# EAGLE board tf328 (EAGLE 8.2.2), part 1 of 2
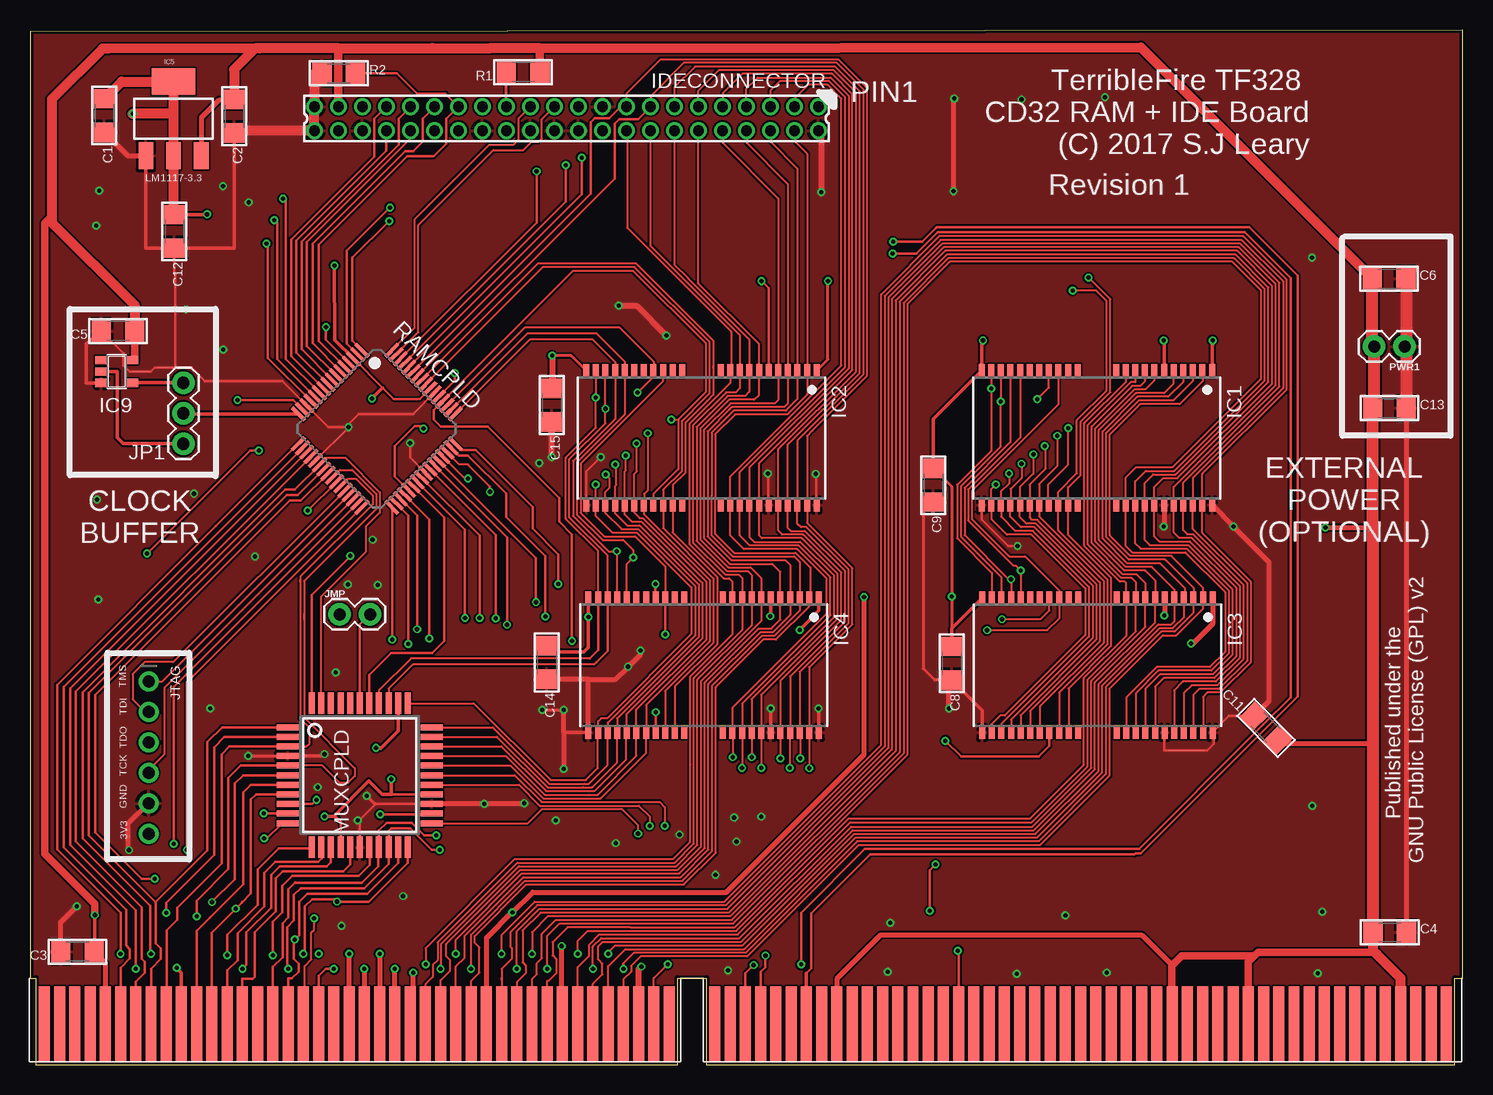
[diagram p4: board, top side]
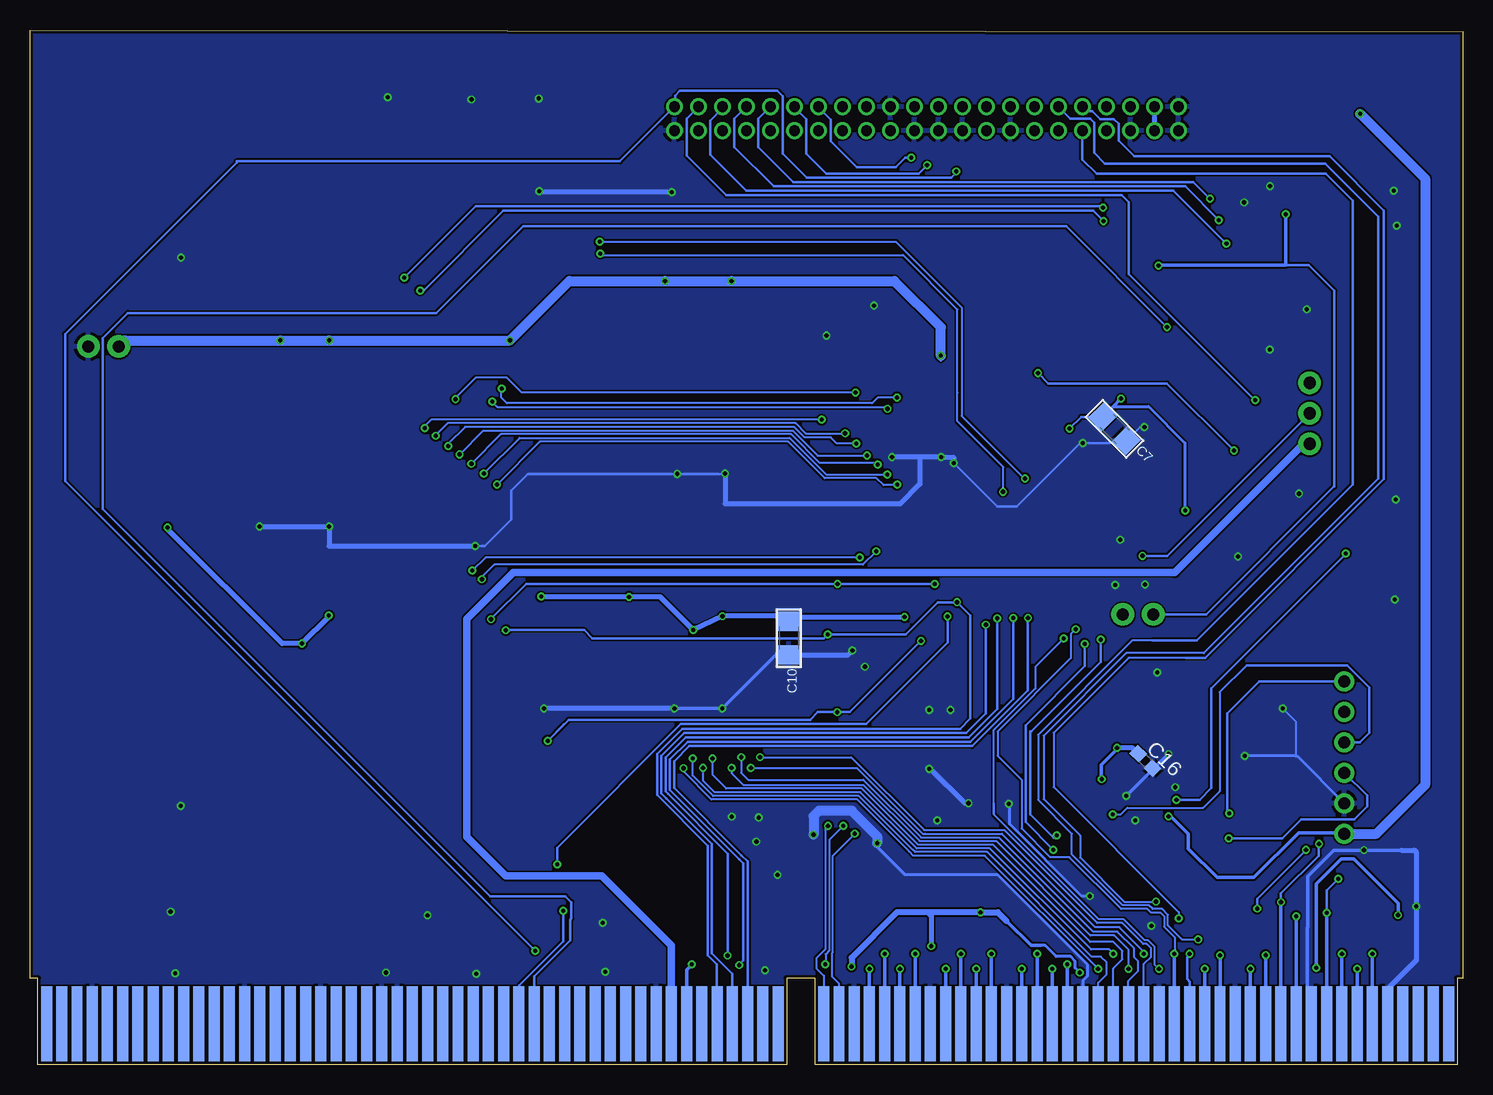
[diagram p5: board, bottom side, seen from below]

Size 119.41 x 86.26 mm. Coordinates in mm from the lower left corner, seen from the top.
Outline: 0.48,0 53.97,0 53.97,7.21 56.36,7.21 56.36,0 118.74,0 118.74,7.21 119.41,7.21 119.41,86.26 0,86.13 0,7.21 0.48,7.21 0.48,0
Copper layers (1*16): Top 0.035mm / dielectric 1.5mm / Bottom 0.035mm
Design rules "dirt_cheap_dirty_boards.v1 (1) *": minimum track width 6mil, minimum drill 12mil, track to track 6mil, track to pad 6mil, pad to pad 6mil, via to via 6mil, smd to smd 0mil, copper to edge 10mil, drill to drill 10mil, minimum pad ring 10mil, minimum via ring 6mil, stop-mask expansion 2mil, vias tented up to drill 25mil, thermal gap 10mil

## Footprints (pad centres in the part's own frame; a part is rotated, then mirrored left to right if it is on the bottom)
1206 = smd 1.6 x 1.8: 1 -1.4,0; 2 1.4,0
C0603 = smd 1.1 x 1: 1 -0.85,0; 2 0.85,0
MCA_CONN_182 = smd 0.914 x 6.223 bottom: PIN1 -5.08,3.81; PIN3 -3.81,3.81; PIN5 -2.54,3.81; PIN7 -1.27,3.81; PIN9 0,3.81; PIN11 1.27,3.81; PIN13 2.54,3.81; PIN15 3.81,3.81; PIN17 5.08,3.81; PIN19 6.35,3.81; PIN21 7.62,3.81; PIN23 8.89,3.81; PIN25 10.16,3.81; PIN27 11.43,3.81; PIN29 12.7,3.81; PIN31 13.97,3.81; PIN33 15.24,3.81; PIN35 16.51,3.81; PIN37 17.78,3.81; PIN39 19.05,3.81; PIN41 20.32,3.81; PIN43 21.59,3.81; PIN45 22.86,3.81; PIN47 24.13,3.81; PIN49 25.4,3.81; PIN51 26.67,3.81; PIN53 27.94,3.81; PIN55 29.21,3.81; PIN57 30.48,3.81; PIN59 31.75,3.81; PIN61 33.02,3.81; PIN63 34.29,3.81; PIN65 35.56,3.81; PIN67 36.83,3.81; PIN69 38.1,3.81; PIN71 39.37,3.81; PIN73 40.64,3.81; PIN75 41.91,3.81; PIN77 43.18,3.81; PIN79 44.45,3.81; PIN81 45.72,3.81; PIN83 46.99,3.81; PIN85 50.8,3.81; PIN87 52.07,3.81; PIN89 53.34,3.81; PIN91 54.61,3.81; PIN93 55.88,3.81; PIN95 57.15,3.81; PIN97 58.42,3.81; PIN99 59.69,3.81; PIN101 60.96,3.81; PIN103 62.23,3.81; PIN105 63.5,3.81; PIN107 64.77,3.81; PIN109 66.04,3.81; PIN111 67.31,3.81; PIN113 68.58,3.81; PIN115 69.85,3.81; PIN117 71.12,3.81; PIN119 72.39,3.81; PIN121 73.66,3.81; PIN123 74.93,3.81; PIN125 76.2,3.81; PIN127 77.47,3.81; PIN129 78.74,3.81; PIN131 80.01,3.81; PIN133 81.28,3.81; PIN135 82.55,3.81; PIN137 83.82,3.81; PIN139 85.09,3.81; PIN141 86.36,3.81; PIN143 87.63,3.81; PIN145 88.9,3.81; PIN147 90.17,3.81; PIN149 91.44,3.81; PIN151 92.71,3.81; PIN153 93.98,3.81; PIN155 95.25,3.81; PIN157 96.52,3.81; PIN159 97.79,3.81; PIN161 99.06,3.81; PIN163 100.33,3.81; PIN165 101.6,3.81; PIN167 102.87,3.81; PIN169 104.14,3.81; PIN171 105.41,3.81; PIN173 106.68,3.81; PIN175 107.95,3.81; PIN177 109.22,3.81; PIN179 110.49,3.81; PIN181 111.76,3.81 | smd 0.914 x 6.223: PIN2 -5.08,3.81; PIN4 -3.81,3.81; PIN6 -2.54,3.81; PIN8 -1.27,3.81; PIN10 0,3.81; PIN12 1.27,3.81; PIN14 2.54,3.81; PIN16 3.81,3.81; PIN18 5.08,3.81; PIN20 6.35,3.81; PIN22 7.62,3.81; PIN24 8.89,3.81; PIN26 10.16,3.81; PIN28 11.43,3.81; PIN30 12.7,3.81; PIN32 13.97,3.81; PIN34 15.24,3.81; PIN36 16.51,3.81; PIN38 17.78,3.81; PIN40 19.05,3.81; PIN42 20.32,3.81; PIN44 21.59,3.81; PIN46 22.86,3.81; PIN48 24.13,3.81; PIN50 25.4,3.81; PIN52 26.67,3.81; PIN54 27.94,3.81; PIN56 29.21,3.81; PIN58 30.48,3.81; PIN60 31.75,3.81; PIN62 33.02,3.81; PIN64 34.29,3.81; PIN66 35.56,3.81; PIN68 36.83,3.81; PIN70 38.1,3.81; PIN72 39.37,3.81; PIN74 40.64,3.81; PIN76 41.91,3.81; PIN78 43.18,3.81; PIN80 44.45,3.81; PIN82 45.72,3.81; PIN84 46.99,3.81; PIN86 50.8,3.81; PIN88 52.07,3.81; PIN90 53.34,3.81; PIN92 54.61,3.81; PIN94 55.88,3.81; PIN96 57.15,3.81; PIN98 58.42,3.81; PIN100 59.69,3.81; PIN102 60.96,3.81; PIN104 62.23,3.81; PIN106 63.5,3.81; PIN108 64.77,3.81; PIN110 66.04,3.81; PIN112 67.31,3.81; PIN114 68.58,3.81; PIN116 69.85,3.81; PIN118 71.12,3.81; PIN120 72.39,3.81; PIN122 73.66,3.81; PIN124 74.93,3.81; PIN126 76.2,3.81; PIN128 77.47,3.81; PIN130 78.74,3.81; PIN132 80.01,3.81; PIN134 81.28,3.81; PIN136 82.55,3.81; PIN138 83.82,3.81; PIN140 85.09,3.81; PIN142 86.36,3.81; PIN144 87.63,3.81; PIN146 88.9,3.81; PIN148 90.17,3.81; PIN150 91.44,3.81; PIN152 92.71,3.81; PIN154 93.98,3.81; PIN156 95.25,3.81; PIN158 96.52,3.81; PIN160 97.79,3.81; PIN162 99.06,3.81; PIN164 100.33,3.81; PIN166 101.6,3.81; PIN168 102.87,3.81; PIN170 104.14,3.81; PIN172 105.41,3.81; PIN174 106.68,3.81; PIN176 107.95,3.81; PIN178 109.22,3.81; PIN180 110.49,3.81; PIN182 111.76,3.81
TSOP44(50)-II = smd 0.5 x 1.1: 1 -9.6,-5.6; 2 -8.8,-5.6; 3 -8,-5.6; 4 -7.2,-5.6; 5 -6.4,-5.6; 6 -5.6,-5.6; 7 -4.8,-5.6; 8 -4,-5.6; 9 -3.2,-5.6; 10 -2.4,-5.6; 11 -1.6,-5.6; 12 1.6,-5.6; 13 2.4,-5.6; 14 3.2,-5.6; 15 4,-5.6; 16 4.8,-5.6; 17 5.6,-5.6; 18 6.4,-5.6; 19 7.2,-5.6; 20 8,-5.6; 21 8.8,-5.6; 22 9.6,-5.6; 23 9.6,5.6; 24 8.8,5.6; 25 8,5.6; 26 7.2,5.6; 27 6.4,5.6; 28 5.6,5.6; 29 4.8,5.6; 30 4,5.6; 31 3.2,5.6; 32 2.4,5.6; 33 1.6,5.6; 34 -1.6,5.6; 35 -2.4,5.6; 36 -3.2,5.6; 37 -4,5.6; 38 -4.8,5.6; 39 -5.6,5.6; 40 -6.4,5.6; 41 -7.2,5.6; 42 -8,5.6; 43 -8.8,5.6; 44 -9.6,5.6
SOT223 = smd 1.219 x 2.235: 1 -2.311,-3.099; 2 0,-3.099; 3 2.311,-3.099 | smd 3.6 x 2.2: 4 0,3.099
SOT23-5 = smd 0.69 x 0.99: 1 -0.95,-1.29; 2 0,-1.29; 3 0.95,-1.29; 4 0.95,1.3; 5 -0.95,1.3
87758-4416 = drill 0.9 pad 1.27: 1 -21,-1; 2 -21,1; 3 -19,-1; 4 -19,1; 5 -17,-1; 6 -17,1; 7 -15,-1; 8 -15,1; 9 -13,-1; 10 -13,1; 11 -11,-1; 12 -11,1; 13 -9,-1; 14 -9,1; 15 -7,-1; 16 -7,1; 17 -5,-1; 18 -5,1; 19 -3,-1; 20 -3,1; 21 -1,-1; 22 -1,1; 23 1,-1; 24 1,1; 25 3,-1; 26 3,1; 27 5,-1; 28 5,1; 29 7,-1; 30 7,1; 31 9,-1; 32 9,1; 33 11,-1; 34 11,1; 35 13,-1; 36 13,1; 37 15,-1; 38 15,1; 39 17,-1; 40 17,1; 41 19,-1; 42 19,1; 43 21,-1; 44 21,1
1X02 = drill 1.016 pad 1.88: 1 0,0; 2 2.54,0
1X03 = drill 1.016 pad 1.88: 1 0,0; 2 2.54,0; 3 5.08,0
1X06_ROUND = drill 1 pad 1.676: 1 -6.35,0; 2 -3.81,0; 3 -1.27,0; 4 1.27,0; 5 3.81,0; 6 6.35,0
SQFP-S-10X10-44 = smd 0.5 x 1.8: 1 -4,-6; 2 -3.2,-6; 3 -2.4,-6; 4 -1.6,-6; 5 -0.8,-6; 6 0,-6; 7 0.8,-6; 8 1.6,-6; 9 2.4,-6; 10 3.2,-6; 11 4,-6; 23 4,6; 24 3.2,6; 25 2.4,6; 26 1.6,6; 27 0.8,6; 28 0,6; 29 -0.8,6; 30 -1.6,6; 31 -2.4,6; 32 -3.2,6; 33 -4,6 | smd 1.8 x 0.5: 12 6,-4; 13 6,-3.2; 14 6,-2.4; 15 6,-1.6; 16 6,-0.8; 17 6,0; 18 6,0.8; 19 6,1.6; 20 6,2.4; 21 6,3.2; 22 6,4; 34 -6,4; 35 -6,3.2; 36 -6,2.4; 37 -6,1.6; 38 -6,0.8; 39 -6,0; 40 -6,-0.8; 41 -6,-1.6; 42 -6,-2.4; 43 -6,-3.2; 44 -6,-4
VQ64 = smd 1.5 x 0.3: 1 -5.5,3.75; 2 -5.5,3.25; 3 -5.5,2.75; 4 -5.5,2.25; 5 -5.5,1.75; 6 -5.5,1.25; 7 -5.5,0.75; 8 -5.5,0.25; 9 -5.5,-0.25; 10 -5.5,-0.75; 11 -5.5,-1.25; 12 -5.5,-1.75; 13 -5.5,-2.25; 14 -5.5,-2.75; 15 -5.5,-3.25; 16 -5.5,-3.75; 33 5.5,-3.75; 34 5.5,-3.25; 35 5.5,-2.75; 36 5.5,-2.25; 37 5.5,-1.75; 38 5.5,-1.25; 39 5.5,-0.75; 40 5.5,-0.25; 41 5.5,0.25; 42 5.5,0.75; 43 5.5,1.25; 44 5.5,1.75; 45 5.5,2.25; 46 5.5,2.75; 47 5.5,3.25; 48 5.5,3.75 | smd 0.3 x 1.5: 17 -3.75,-5.5; 18 -3.25,-5.5; 19 -2.75,-5.5; 20 -2.25,-5.5; 21 -1.75,-5.5; 22 -1.25,-5.5; 23 -0.75,-5.5; 24 -0.25,-5.5; 25 0.25,-5.5; 26 0.75,-5.5; 27 1.25,-5.5; 28 1.75,-5.5; 29 2.25,-5.5; 30 2.75,-5.5; 31 3.25,-5.5; 32 3.75,-5.5; 49 3.75,5.5; 50 3.25,5.5; 51 2.75,5.5; 52 2.25,5.5; 53 1.75,5.5; 54 1.25,5.5; 55 0.75,5.5; 56 0.25,5.5; 57 -0.25,5.5; 58 -0.75,5.5; 59 -1.25,5.5; 60 -1.75,5.5; 61 -2.25,5.5; 62 -2.75,5.5; 63 -3.25,5.5; 64 -3.75,5.5

## Placement (x,y rotation side)
C1  10uF  [1206]  6.2,79.12 270 top
C2  10uF  [1206]  17.02,79.07 270 top
C3  10uF  [1206]  3.96,9.4 180 top
C4  22uF  [1206]  113.31,11.05 0 top
C5  100nF  [1206]  7.34,61.16 180 top
C6  22uF  [1206]  113.26,65.53 0 top
C7  1uF  [1206]  29.03,53.01 315 bottom
C8  100nF  [1206]  76.81,33.45 270 top
C9  100nF  [1206]  75.29,48.31 270 top
C10  10uF  [1206]  56.18,35.56 270 bottom
C11  22uF  [1206]  103,28.07 135 top
C12  22uF  [1206]  12.04,69.47 270 top
C13  22uF  [1206]  113.28,54.74 0 top
C14  100nF  [1206]  43.05,33.53 270 top
C15  100nF  [1206]  43.48,54.99 270 top
C16  1uF  [C0603]  26.47,25.32 315 bottom
CONN1  MCA_CONN_182  [MCA_CONN_182]  6.27,-0.41 0 top
IC1  IS41C16100C  [TSOP44(50)-II]  88.9,52.25 180 top
IC2  IS41C16100C  [TSOP44(50)-II]  55.96,52.25 180 top
IC3  IS41C16100C  [TSOP44(50)-II]  88.95,33.3 180 top
IC4  IS41C16100C  [TSOP44(50)-II]  56.13,33.3 180 top
IC5  LM1117-3.3  [SOT223]  11.96,78.87 0 top
IC9  74LVC1G17DBV  [SOT23-5]  7.24,57.79 270 top
IDECONNECTOR  87758-4416  [87758-4416]  44.7,78.87 180 top
JMP  Optional  [1X02]  25.81,37.54 0 top
JP1  CLOCKSEL  [1X03]  12.78,51.77 90 top
JTAG  JTAG  [1X06_ROUND]  9.88,25.6 270 top
MUXCPLD  XC9536_44VQ  [SQFP-S-10X10-44]  27.48,24.13 270 top
PWR1  EXT5V  [1X02]  114.55,59.87 180 top
R1  1K  [1206]  41.1,82.73 180 top
R2  1K  [1206]  25.73,82.65 0 top
RAMCPLD  XC9572XL-VQ64  [VQ64]  28.91,53.01 315 top